# Altium schematic sheet 核心板.SchDoc
size A2
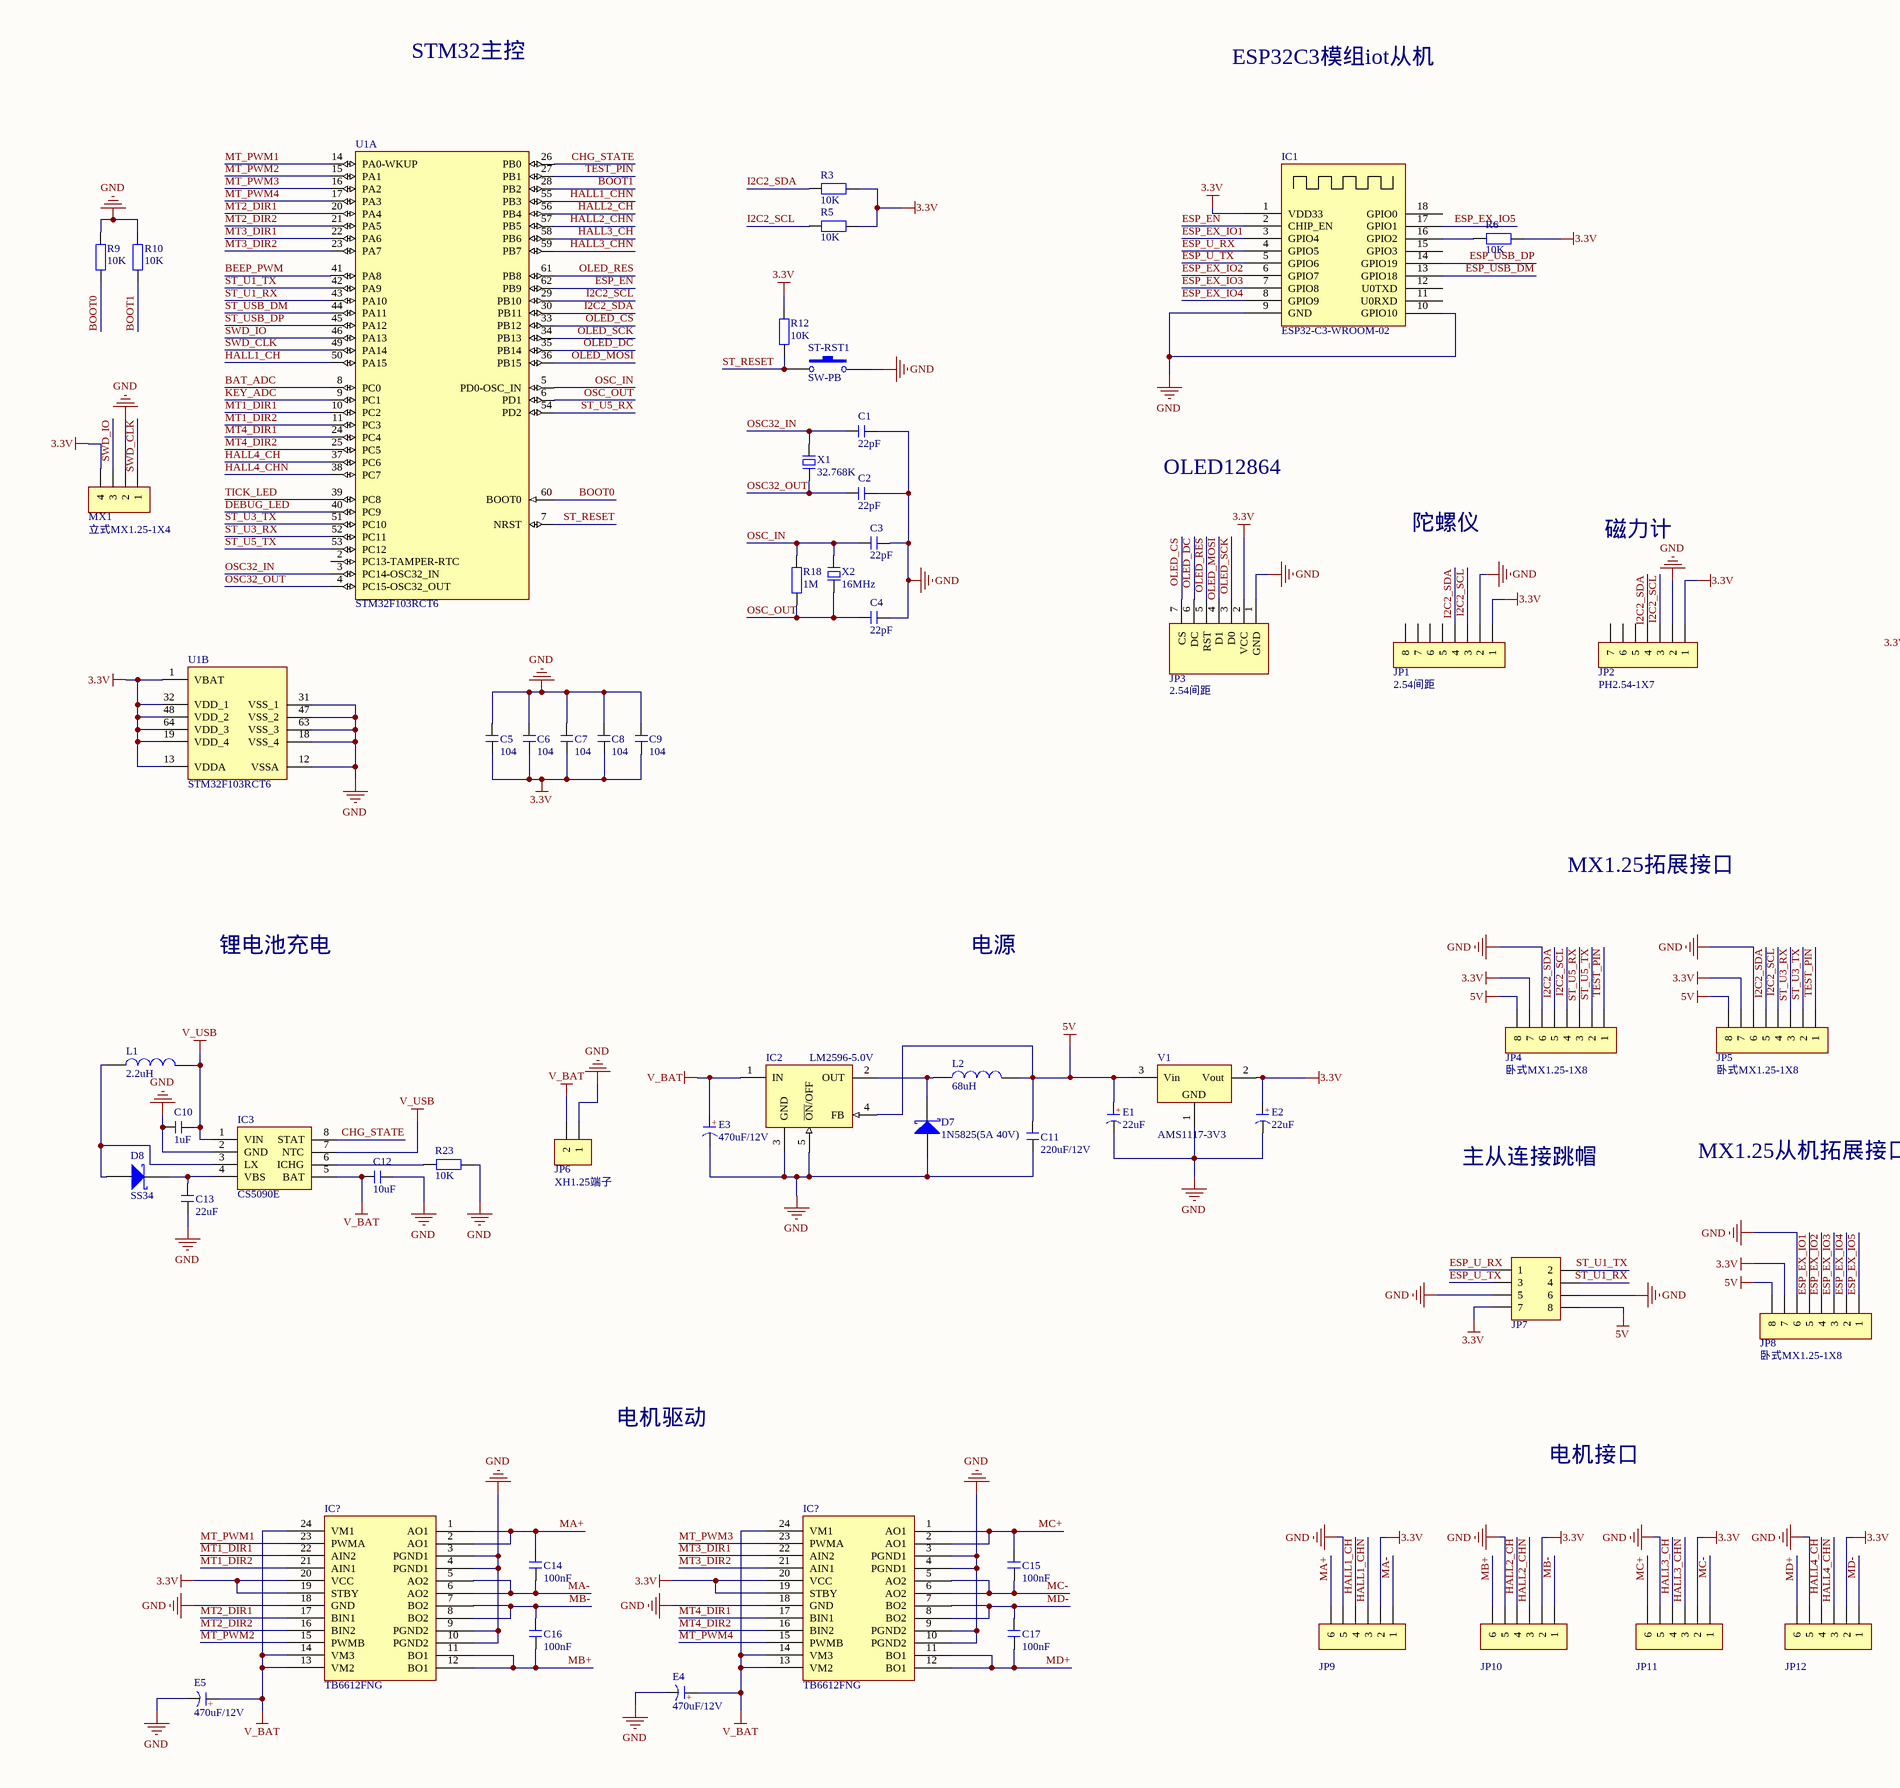
[diagram p0: 核心板.SchDoc, left]
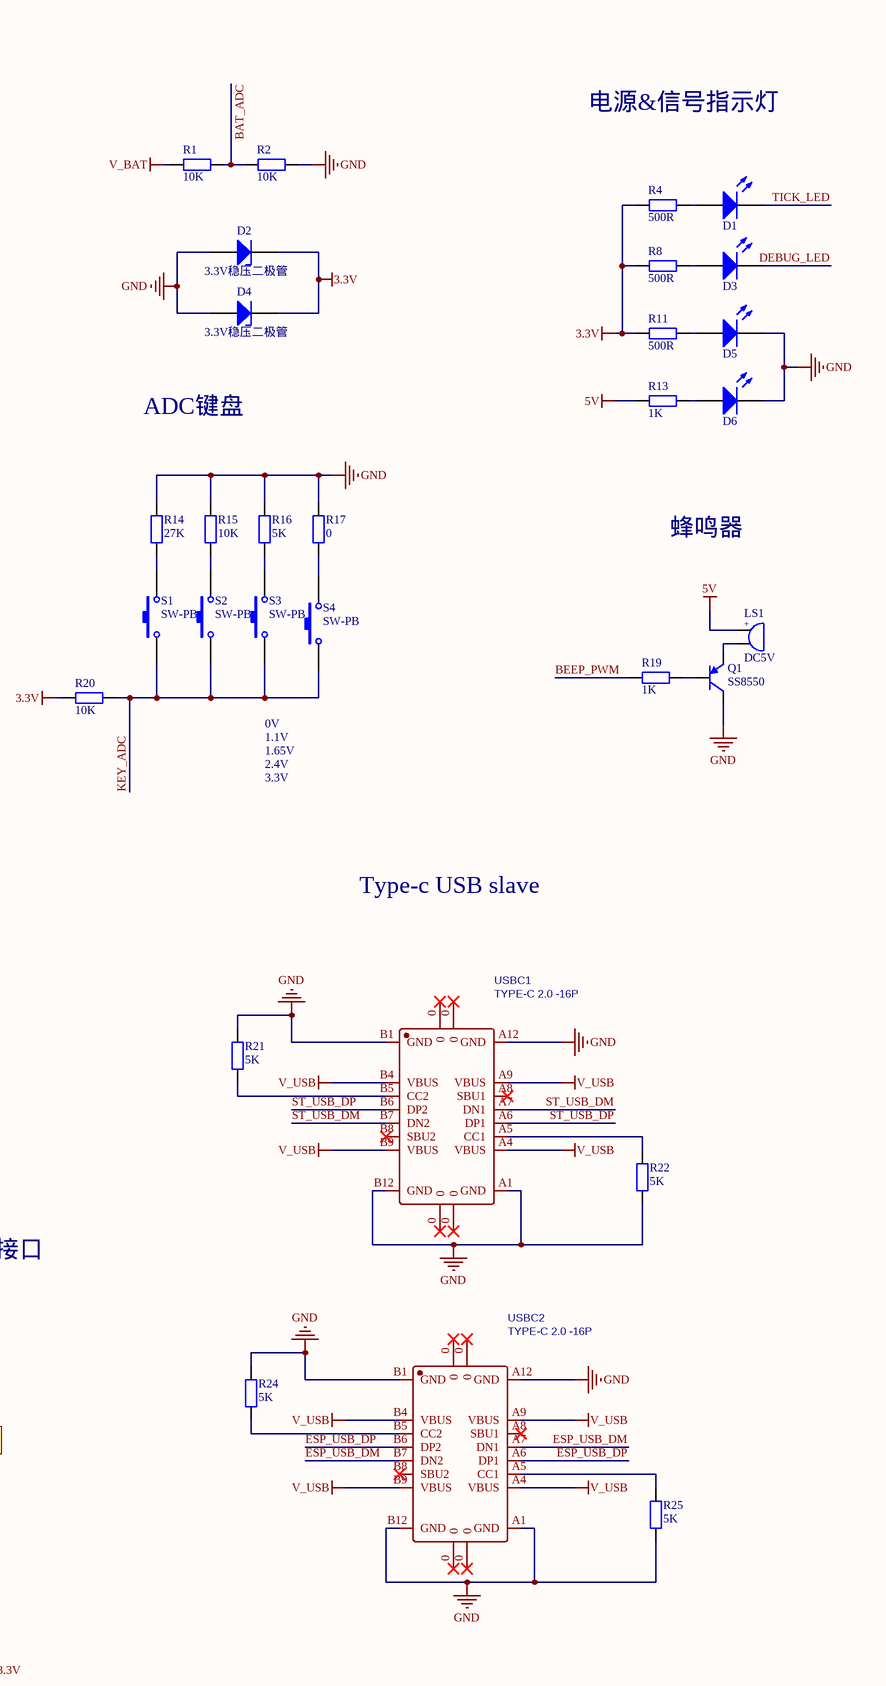
[diagram p1: 核心板.SchDoc, right]

## Parts
(Parts that share a designator on the sheet are numbered #1, #2 ... from top to bottom, then left to right.)
C1  22pF
C2  22pF
C3  22pF
C4  22pF
C5  104
C6  104
C7  104
C8  104
C9  104
C10  1uF
C11  220uF/12V
C12  10uF
C13  22uF
C14  100nF
C15  100nF
C16  100nF
C17  100nF
D1  LED  (value not drawn)
D2  3.3V稳压二极管
D3  LED  (value not drawn)
D4  3.3V稳压二极管
D5  LED  (value not drawn)
D6  LED  (value not drawn)
D7  1N5825(5A 40V)
D8  SS34
E1  22uF
E2  22uF
E3  470uF/12V
E4  470uF/12V
E5  470uF/12V
IC1  ESP32-C3-WROOM-02
IC2  LM2596-5.0V
IC3  CS5090E
IC?#1  TB6612FNG
IC?#2  TB6612FNG
JP1  2.54间距
JP2  PH2.54-1X7
JP3  2.54间距
JP4  卧式MX1.25-1X8
JP5  卧式MX1.25-1X8
JP6  XH1.25端子
JP7  Header 4X2  (value not drawn)
JP8  卧式MX1.25-1X8
JP9  HDR-1X6  (value not drawn)
JP10  HDR-1X6  (value not drawn)
JP11  HDR-1X6  (value not drawn)
JP12  HDR-1X6  (value not drawn)
L1  2.2uH
L2  68uH
LS1  DC5V
MX1  立式MX1.25-1X4
Q1  SS8550
R1  10K
R2  10K
R3  10K
R4  500R
R5  10K
R6  10K
R8  500R
R9  10K
R10  10K
R11  500R
R12  10K
R13  1K
R14  27K
R15  10K
R16  5K
R17  0
R18  1M
R19  1K
R20  10K
R21  5K
R22  5K
R23  10K
R24  5K
R25  5K
S1  SW-PB
S2  SW-PB
S3  SW-PB
S4  SW-PB
ST-RST1  SW-PB
U1  STM32F103RCT6  (parts A,B of 2)
USBC1  TYPE-C 2.0 -16P  [USB-C-SMD_TYPE-C-USB-5]
USBC2  TYPE-C 2.0 -16P  [USB-C-SMD_TYPE-C-USB-5]
V1  AMS1117-3V3  [SOT223_L]
X1  32.768K  [OSC HC-49S]
X2  16MHz

## Nets
3.3V: C5.2 C6.2 C7.2 C8.2 C9.2 D2.2(K) D4.2(K) E2.1(A) IC1.1(VDD33) IC?#1.19(STBY) IC?#1.20(VCC) IC?#2.19(STBY) IC?#2.20(VCC) JP1.1 JP2.1 JP3.2(VCC) JP4.3(7) JP5.3(7) JP7.7 JP8.3(7) JP9.2 JP10.2 JP11.2 JP12.2 MX1.4 R3.2 R4.2 R5.2 R6.2 R8.2 R11.2 R12.1 R20.1 U1.1(VBAT) U1.13(VDDA) U1.19(VDD_4) U1.32(VDD_1) U1.48(VDD_2) U1.64(VDD_3) V1.2(Vout)
5V: C11.1 E1.1(A) IC2.4(FB) JP4.4(8) JP5.4(8) JP7.8 JP8.4(8) L2.2 LS1.1 R13.2 V1.3(Vin)
GND: C1.1 C2.1 C3.1 C4.1 C5.1 C6.1 C7.1 C8.1 C9.1 C10.1 C11.2 C12.2 C13.2 D2.1(A) D4.1(A) D5.2(K) D6.2(K) D7.1(A) E1.2(K) E2.2(K) E3.2(K) E4.2(K) E5.2(K) IC1.9(GND) IC1.10(GPIO10) IC2.3(GND) IC2.5(~{ON}/OFF) IC3.2(GND) IC?#1.3(PGND1) IC?#1.4(PGND1) IC?#1.9(PGND2) IC?#1.10(PGND2) IC?#1.18(GND) IC?#2.3(PGND1) IC?#2.4(PGND1) IC?#2.9(PGND2) IC?#2.10(PGND2) IC?#2.18(GND) JP1.2 JP2.2 JP3.1(GND) JP4.2(6) JP5.2(6) JP6.1 JP7.5 JP7.6 JP8.2(6) JP9.5 JP10.5 JP11.5 JP12.5 MX1.2 Q1.3(C) R2.1 R9.1 R10.1 R14.2 R15.2 R16.2 R17.2 R21.2 R22.1 R23.1 R24.2 R25.1 ST-RST1.2 U1.12(VSSA) U1.18(VSS_4) U1.31(VSS_1) U1.47(VSS_2) U1.63(VSS_3) USBC1.A1(GND) USBC1.A12(GND) USBC1.B1(GND) USBC1.B12(GND) USBC2.A1(GND) USBC2.A12(GND) USBC2.B1(GND) USBC2.B12(GND) V1.1(GND)
V_BAT: C12.1 E3.1(A) E4.1(A) E5.1(A) IC2.1(IN) IC3.5(BAT) IC?#1.13(VM2) IC?#1.14(VM3) IC?#1.24(VM1) IC?#2.13(VM2) IC?#2.14(VM3) IC?#2.24(VM1) JP6.2 R1.2
V_USB: C10.2 IC3.1(VIN) IC3.7(NTC) L1.2 USBC1.A4(VBUS) USBC1.A9(VBUS) USBC1.B4(VBUS) USBC1.B9(VBUS) USBC2.A4(VBUS) USBC2.A9(VBUS) USBC2.B4(VBUS) USBC2.B9(VBUS)
BAT_ADC: R1.1 R2.2 U1.8(PC0)
BEEP_PWM: R19.2 U1.41(PA8)
BOOT0: R9.2 U1.60(BOOT0)
BOOT1: R10.2 U1.28(PB2)
CHG_STATE: IC3.8(STAT) U1.26(PB0)
DEBUG_LED: D3.2(K) U1.40(PC9)
ESP_EN: IC1.2(CHIP_EN) U1.62(PB9)
ESP_EX_IO1: IC1.3(GPIO4) JP8.1(5)
ESP_EX_IO2: IC1.6(GPIO7) JP8.4
ESP_EX_IO3: IC1.7(GPIO8) JP8.3
ESP_EX_IO4: IC1.8(GPIO9) JP8.2
ESP_EX_IO5: IC1.17(GPIO1) JP8.1
ESP_U_RX: IC1.4(GPIO5) JP7.1
ESP_U_TX: IC1.5(GPIO6) JP7.3
ESP_USB_DM: IC1.13(GPIO18) USBC2.A7(DN1) USBC2.B7(DN2)
ESP_USB_DP: IC1.14(GPIO19) USBC2.A6(DP1) USBC2.B6(DP2)
HALL1_CH: JP9.4 U1.50(PA15)
HALL1_CHN: JP9.3 U1.55(PB3)
HALL2_CH: JP10.4 U1.56(PB4)
HALL2_CHN: JP10.3 U1.57(PB5)
HALL3_CH: JP11.4 U1.58(PB6)
HALL3_CHN: JP11.3 U1.59(PB7)
HALL4_CH: JP12.4 U1.37(PC6)
HALL4_CHN: JP12.3 U1.38(PC7)
I2C2_SCL: JP1.3 JP2.3 JP4.4 JP5.4 R5.1 U1.29(PB10)
I2C2_SDA: JP1.4 JP2.4 JP4.1(5) JP5.1(5) R3.1 U1.30(PB11)
KEY_ADC: R20.2 S1.1 S2.1 S3.1 S4.1 U1.9(PC1)
MA+: C14.1 IC?#1.1(AO1) IC?#1.2(AO1) JP9.6
MA-: C14.2 IC?#1.5(AO2) IC?#1.6(AO2) JP9.1
MB+: C16.2 IC?#1.11(BO1) IC?#1.12(BO1) JP10.6
MB-: C16.1 IC?#1.7(BO2) IC?#1.8(BO2) JP10.1
MC+: C15.1 IC?#2.1(AO1) IC?#2.2(AO1) JP11.6
MC-: C15.2 IC?#2.5(AO2) IC?#2.6(AO2) JP11.1
MD+: C17.2 IC?#2.11(BO1) IC?#2.12(BO1) JP12.6
MD-: C17.1 IC?#2.7(BO2) IC?#2.8(BO2) JP12.1
MT1_DIR1: IC?#1.22(AIN2) U1.10(PC2)
MT1_DIR2: IC?#1.21(AIN1) U1.11(PC3)
MT2_DIR1: IC?#1.17(BIN1) U1.20(PA4)
MT2_DIR2: IC?#1.16(BIN2) U1.21(PA5)
MT3_DIR1: IC?#2.22(AIN2) U1.22(PA6)
MT3_DIR2: IC?#2.21(AIN1) U1.23(PA7)
MT4_DIR1: IC?#2.17(BIN1) U1.24(PC4)
MT4_DIR2: IC?#2.16(BIN2) U1.25(PC5)
MT_PWM1: IC?#1.23(PWMA) U1.14(PA0-WKUP)
MT_PWM2: IC?#1.15(PWMB) U1.15(PA1)
MT_PWM3: IC?#2.23(PWMA) U1.16(PA2)
MT_PWM4: IC?#2.15(PWMB) U1.17(PA3)
OLED_CS: JP3.7(CS) U1.33(PB12)
OLED_DC: JP3.6(DC) U1.35(PB14)
OLED_MOSI: JP3.4(D1) U1.36(PB15)
OLED_RES: JP3.5(RST) U1.61(PB8)
OLED_SCK: JP3.3(D0) U1.34(PB13)
OSC32_IN: C1.2 U1.3(PC14-OSC32_IN) X1.1
OSC32_OUT: C2.2 U1.4(PC15-OSC32_OUT) X1.2
OSC_IN: C3.2 R18.2 U1.5(PD0-OSC_IN) X2.1
OSC_OUT: C4.2 R18.1 U1.6(PD1) X2.2
ST_RESET: R12.2 ST-RST1.1 U1.7(NRST)
ST_U1_RX: JP7.4 U1.43(PA10)
ST_U1_TX: JP7.2 U1.42(PA9)
ST_U3_RX: JP5.3 U1.52(PC11)
ST_U3_TX: JP5.2 U1.51(PC10)
ST_U5_RX: JP4.3 U1.54(PD2)
ST_U5_TX: JP4.2 U1.53(PC12)
ST_USB_DM: U1.44(PA11) USBC1.A7(DN1) USBC1.B7(DN2)
ST_USB_DP: U1.45(PA12) USBC1.A6(DP1) USBC1.B6(DP2)
SWD_CLK: MX1.1 U1.49(PA14)
SWD_IO: MX1.3 U1.46(PA13)
TEST_PIN: JP4.1 JP5.1 U1.27(PB1)
TICK_LED: D1.2(K) U1.39(PC8)
NetC13_1: C13.1 D8.2(K) IC3.4(VBS)
NetD1_1: D1.1(A) R4.1
NetD3_1: D3.1(A) R8.1
NetD5_1: D5.1(A) R11.1
NetD6_1: D6.1(A) R13.1
NetD7_2: D7.2(K) IC2.2(OUT) L2.1
NetD8_1: D8.1(A) IC3.3(LX) L1.1
NetIC1_16: IC1.16(GPIO2) R6.1
NetIC3_6: IC3.6(ICHG) R23.2
NetLS1_2: LS1.2 Q1.2(E)
NetQ1_1: Q1.1(B) R19.1
NetR14_1: R14.1 S1.2
NetR15_1: R15.1 S2.2
NetR16_1: R16.1 S3.2
NetR17_1: R17.1 S4.2
NetR21_1: R21.1 USBC1.B5(CC2)
NetR22_2: R22.2 USBC1.A5(CC1)
NetR24_1: R24.1 USBC2.B5(CC2)
NetR25_2: R25.2 USBC2.A5(CC1)

Not connected (* = marked no-connect by the designer): IC1 11(U0RXD) 12(U0TXD) 15(GPIO3) 18(GPIO0); U1 2(PC13-TAMPER-RTC); USBC1 0* A8(SBU1)* B8(SBU2)*; USBC2 0* A8(SBU1)* B8(SBU2)*

## Notes on the sheet
- STM32主控
- ESP32C3模组iot从机
- 电源&信号指示灯
- ADC键盘
- OLED12864
- 蜂鸣器
- 陀螺仪
- 磁力计
- 0V
- 1.1V
- 1.65V
- 3.3V
- 2.4V
- Type-c USB slave
- MX1.25拓展接口
- 锂电池充电
- 电源
- 主从连接跳帽
- MX1.25从机拓展接口
- 电机驱动
- 电机接口
- (in symbol BEEP) +
- (in symbol C-CM) +
- (in symbol CS_SMD) +

## Library data of the parts
C1-C17 = C: 贴片电容; BOM名称: 无极性贴片电容; 淘宝ID: 封装库来自淘宝 ID：黄晶宝石; 联系售后，技术支持: https://shop463601444.taobao.com; 唯一出售店铺网址: https://shop463601444.taobao.com
D1 D3 D5 D6 = LED: 发光二极管; 技术支持，联系售后: https://shop463601444.taobao.com
D2 D4 = 稳压二极管: Zener Diode; 封装库来自淘宝卖家 ID：黄晶宝石: 其他店铺购入均为盗版，不享受售后技术支持服务，请立即申请退款
D7 = 1N5819: 肖特基二极管; 淘宝ID: 封装库来自淘宝 ID：黄晶宝石; 属性: 40V/2A; BOM名称: 肖特基二极管; 欢迎光临: https://shop463601444.taobao.com
D8 = SS34: 肖特基二极管; 属性: 40V/3A; BOM名称: 肖特基二极管; 封装库来自淘宝 ID：黄晶宝石: https://shop463601444.taobao.com
E1 E2 = CS_SMD: 贴片固态电容; 版权归属: 封装库来自淘宝 ID：黄晶宝石; BOM名称: 贴片固态电容; 联系售后: https://shop463601444.taobao.com
E3-E5 = C-CM: 贴片电解电容; 版权归属: 封装库来自淘宝 ID：黄晶宝石; BOM名称: 贴片电解电容; 联系售后: https://shop463601444.taobao.com
IC1 = ESP32-C3-WROOM-02: ESP32C3模组
IC2 = LM2596-5.0: DC降压芯片; BOM名称: DC稳压芯片; 版权归属: 封装库来自淘宝 ID：黄晶宝石; 学习资源: https://shop463601444.taobao.com
IC3 = CS5090E: 8.4V锂电池充电芯片
IC?#1 IC?#2 = TB6612FNG: 电机驱动IC
JP1 JP4 JP5 JP8 = Header 8: 8P接插件; BOM名称: 4P接插件; 联系售后: 封装库来自淘宝 ID：黄晶宝石; 学习资源: https://shop463601444.taobao.com
JP2 = Header 7: 7P接插件 - SPI ssd1306; BOM名称: 4P接插件; 联系售后: 封装库来自淘宝 ID：黄晶宝石; 学习资源: https://shop463601444.taobao.com
JP3 = OLED 1.3-12864_7pin: 12864 点阵屏; 版权归属: 封装库来自淘宝 ID：黄晶宝石; BOM名称: 12864 点阵屏; 技术支持，联系售后: https://shop463601444.taobao.com
JP6 = Header 2
JP7 = Header 4X2: 4*2P接插件; 版权归属: 封装库来自淘宝 ID：黄晶宝石; BOM名称: 4*2P接插件; 学习资源: https://shop463601444.taobao.com
JP9-JP12 = Header 6: 6P接插件; 版权归属: 封装库来自淘宝 ID：黄晶宝石; BOM名称: 6P接插件; 学习资源: https://shop463601444.taobao.com
L1 L2 = L: 小功率贴片电感; 淘宝ID: 封装库来自淘宝 ID：黄晶宝石; 封装库来自淘宝卖家 ID：黄晶宝石: 其他店铺购入均为盗版，不享受售后技术支持服务，请立即申请退款; BOM名称: 小功率贴片电感; 联系售后: https://shop463601444.taobao.com
LS1 = BEEP: 蜂鸣器; 版权归属: 封装库来自淘宝 ID：黄晶宝石; BOM名称: 蜂鸣器; 技术支持，联系售后: https://shop463601444.taobao.com
MX1 = Header 4: 4P接插件; 联系售后: 封装库来自淘宝 ID：黄晶宝石; BOM名称: 4P接插件; 学习资源: https://shop463601444.taobao.com
Q1 = 8550-SMD: 高频放大-PNP型; 版权归属: 封装库来自淘宝 ID：黄晶宝石; 属性: 40V 1.5A 1W 100MHZ; BOM名称: 高频放大-PNP型; 学习资源: www.ooocke.com
R1-R6 R8-R25 = R: 贴片电阻; 版权归属: 来自淘宝 ID：黄晶宝石; 封装库来自淘宝卖家 ID：黄晶宝石: 其他店铺购入均为盗版，不享受售后技术支持服务，请立即申请退款; BOM名称: 贴片电阻; 联系售后: https://shop463601444.taobao.com
S1-S4 ST-RST1 = SW-PB: 微动开关; Published: 24-Mar-1999; LatestRevisionDate: 17-Jul-2002; LatestRevisionNote: Re-released for DXP Platform.; PackageReference: SPST-2; Publisher: Altium Limited
U1 = STM32F103RCT6: STM32 ARM-based 32-bit MCU Performance Line with 256 kB Flash, 48 kB Internal RAM, -40 to +85癈 Temperature, 64-Pin LQFP, Tray; DatasheetVersion: rev8.0, Apr-2011; PackageVersion: rev13, Apr-2011; PackageReference: LQFP64; PackageDescription: 64-Pin Low-Profile Quad Flat Pack, 10 x 10 mm Body, 0.5 mm Pitch (LQFP64); ComponentLink1Description: Manufacturer URL; ComponentLink1URL: http://www.st.com/; ComponentLink2Description: STM32F103 Datasheet; ComponentLink2URL: http://www.st.com/internet/com/TECHNICAL_RESOURCES/TECHNICAL_LITERATURE/DATASHEET/CD00191185.pdf; ComponentLink3Description: STM32 Family Web Page; ComponentLink3URL: www.st.com/stm32
USBC1 USBC2 = USB2.0 Type-C 16Pin母座: USB2.0 Type-C 母座 16Pin; BOM_Manufacturer: LCSC; BOM_Supplier: LCSC; BOM_Manufacturer Part: -; spicePre: U; spiceSymbolName: TYPE-C 3.1 -16P_C168689
V1 = AMS1117: 三端稳压芯片; BOM名称: 稳压芯片; 淘宝ID: 封装库来自淘宝 ID：黄晶宝石; 欢迎光临淘宝店铺: https://shop463601444.taobao.com
X1 X2 = XTAL-2P: 2脚无源脚晶振; 版权归属: 封装库来自淘宝卖家 ID：黄晶宝石; BOM名称: 2脚无源脚晶振; 学习资源: https://shop463601444.taobao.com